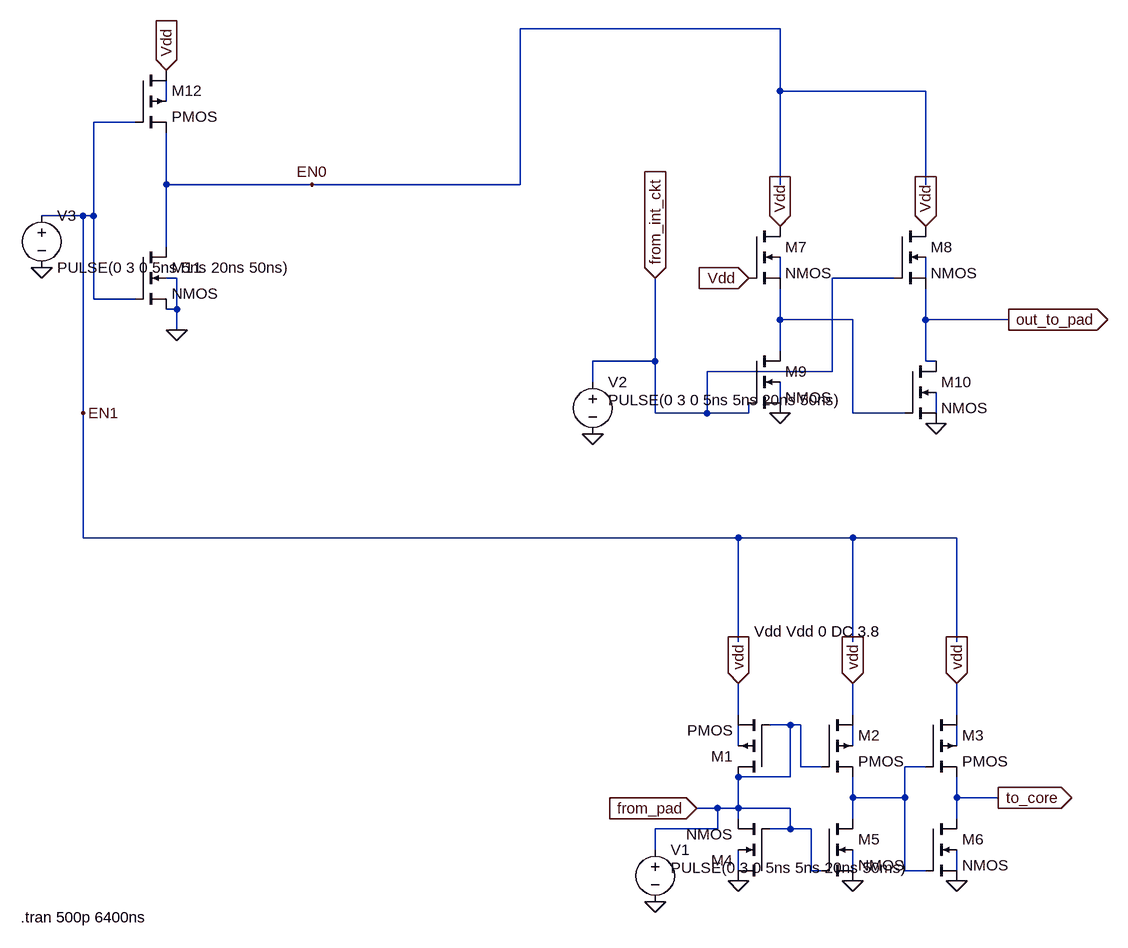
[diagram p0: schematic Gpio@bidibuff.asc]
Gpio@bidibuff.asc, the LTspice schematic file:
Version 4
SHEET 1 880 680
WIRE 144 -1040 -256 -1040
WIRE 144 -944 144 -1040
WIRE 368 -944 144 -944
WIRE -800 -928 -800 -960
WIRE -848 -896 -912 -896
WIRE -800 -800 -800 -880
WIRE -576 -800 -800 -800
WIRE -256 -800 -256 -1040
WIRE -256 -800 -576 -800
WIRE 144 -800 144 -944
WIRE 368 -800 368 -944
WIRE -928 -752 -992 -752
WIRE -912 -752 -912 -896
WIRE -912 -752 -928 -752
WIRE -800 -704 -800 -800
WIRE -784 -656 -800 -656
WIRE 144 -656 144 -688
WIRE 320 -656 224 -656
WIRE 368 -656 368 -688
WIRE -912 -624 -912 -752
WIRE -848 -624 -912 -624
WIRE -784 -608 -784 -656
WIRE -784 -608 -800 -608
WIRE 144 -592 144 -640
WIRE 256 -592 144 -592
WIRE 368 -592 368 -640
WIRE 496 -592 368 -592
WIRE -784 -576 -784 -608
WIRE 144 -544 144 -592
WIRE -48 -528 -48 -656
WIRE -48 -528 -144 -528
WIRE 368 -528 368 -592
WIRE 384 -528 368 -528
WIRE 224 -512 224 -656
WIRE 224 -512 32 -512
WIRE -144 -496 -144 -528
WIRE 144 -464 144 -496
WIRE -928 -448 -928 -752
WIRE -48 -448 -48 -528
WIRE 32 -448 32 -512
WIRE 32 -448 -48 -448
WIRE 96 -448 96 -464
WIRE 96 -448 32 -448
WIRE 256 -448 256 -592
WIRE 336 -448 256 -448
WIRE 384 -448 384 -480
WIRE -928 -256 -928 -448
WIRE 80 -256 -928 -256
WIRE 256 -256 80 -256
WIRE 416 -256 256 -256
WIRE 80 -96 80 -256
WIRE 256 -96 256 -256
WIRE 416 -96 416 -256
WIRE 80 16 80 -32
WIRE 256 16 256 -32
WIRE 416 16 416 -32
WIRE 160 32 128 32
WIRE 176 32 160 32
WIRE 80 64 80 32
WIRE 256 64 256 32
WIRE 416 64 416 32
WIRE 176 96 176 32
WIRE 208 96 176 96
WIRE 368 96 336 96
WIRE 160 112 160 32
WIRE 160 112 80 112
WIRE 256 144 256 112
WIRE 336 144 336 96
WIRE 336 144 256 144
WIRE 416 144 416 112
WIRE 480 144 416 144
WIRE 48 160 16 160
WIRE 80 160 80 112
WIRE 80 160 48 160
WIRE 160 160 80 160
WIRE 80 176 80 160
WIRE 256 176 256 144
WIRE 416 176 416 144
WIRE 48 192 48 160
WIRE 48 192 -48 192
WIRE 160 192 160 160
WIRE 160 192 128 192
WIRE 192 192 160 192
WIRE -48 224 -48 192
WIRE 80 256 80 224
WIRE 192 256 192 192
WIRE 208 256 192 256
WIRE 256 256 256 224
WIRE 336 256 336 144
WIRE 368 256 336 256
WIRE 416 256 416 224
FLAG 80 272 0
FLAG 256 272 0
FLAG 416 272 0
FLAG 16 160 from_pad
IOPIN 16 160 In
FLAG 480 144 to_core
IOPIN 480 144 Out
FLAG 80 -32 vdd
IOPIN 80 -32 In
FLAG 256 -32 vdd
IOPIN 256 -32 In
FLAG 416 -32 vdd
IOPIN 416 -32 In
FLAG -48 304 0
FLAG 384 -432 0
FLAG 144 -448 0
FLAG 144 -736 Vdd
IOPIN 144 -736 In
FLAG 368 -736 Vdd
IOPIN 368 -736 In
FLAG 96 -656 Vdd
IOPIN 96 -656 In
FLAG 496 -592 out_to_pad
IOPIN 496 -592 Out
FLAG -144 -416 0
FLAG -48 -656 from_int_ckt
IOPIN -48 -656 In
FLAG -784 -576 0
FLAG -992 -672 0
FLAG -800 -976 Vdd
IOPIN -800 -976 In
FLAG -928 -448 EN1
FLAG -576 -800 EN0
SYMBOL pmos4 128 112 R180
SYMATTR InstName M1
SYMBOL pmos4 208 16 R0
SYMATTR InstName M2
SYMBOL pmos4 368 16 R0
SYMATTR InstName M3
SYMBOL nmos4 208 176 R0
SYMATTR InstName M5
SYMBOL nmos4 368 176 R0
SYMATTR InstName M6
SYMBOL nmos4 128 272 R180
SYMATTR InstName M4
SYMBOL voltage -48 208 R0
WINDOW 123 0 0 Left 0
WINDOW 39 0 0 Left 0
WINDOW 3 24 44 Left 2
SYMATTR Value PULSE(0 3 0 5ns 5ns 20ns 50ms)
SYMATTR InstName V1
SYMBOL nmos4 96 -736 R0
SYMATTR InstName M7
SYMBOL nmos4 320 -736 R0
SYMATTR InstName M8
SYMBOL nmos4 96 -544 R0
SYMATTR InstName M9
SYMBOL nmos4 336 -528 R0
SYMATTR InstName M10
SYMBOL voltage -144 -512 R0
WINDOW 3 24 44 Left 2
WINDOW 123 0 0 Left 0
WINDOW 39 0 0 Left 0
SYMATTR Value PULSE(0 3 0 5ns 5ns 20ns 50ns)
SYMATTR InstName V2
SYMBOL nmos4 -848 -704 R0
SYMATTR InstName M11
SYMBOL pmos4 -848 -976 R0
SYMATTR InstName M12
SYMBOL voltage -992 -768 R0
WINDOW 123 0 0 Left 0
WINDOW 39 0 0 Left 0
SYMATTR InstName V3
SYMATTR Value PULSE(0 3 0 5ns 5ns 20ns 50ns)
TEXT 104 -112 Left 2 !Vdd Vdd 0 DC 3.8
TEXT -1024 328 Left 2 !.tran 500p 6400ns

The netlist it stands for:
* Gpio@bidibuff.asc
M1 from_pad from_pad vdd N007 PMOS
M2 vdd from_pad N010 N008 PMOS
M3 vdd N010 to_core N009 PMOS
M5 N010 from_pad 0 N012 NMOS
M6 to_core N010 0 N013 NMOS
M4 0 from_pad from_pad N011 NMOS
V1 from_pad 0 PULSE(0 3 0 5ns 5ns 20ns 50ms)
M7 vdd vdd N004 N002 NMOS
M8 vdd from_int_ckt out_to_pad N003 NMOS
M9 N004 from_int_ckt 0 N005 NMOS
M10 out_to_pad N004 0 N006 NMOS
V2 from_int_ckt 0 PULSE(0 3 0 5ns 5ns 20ns 50ns)
M11 EN0 EN1 0 0 NMOS
M12 vdd EN1 EN0 N001 PMOS
V3 EN1 0 PULSE(0 3 0 5ns 5ns 20ns 50ns)
.model NMOS NMOS
.model PMOS PMOS
.lib standard.mos
Vdd Vdd 0 DC 3.8
.tran 500p 6400ns
.backanno
.end

* Results of the author's LTspice run, read from the files saved beside the schematic
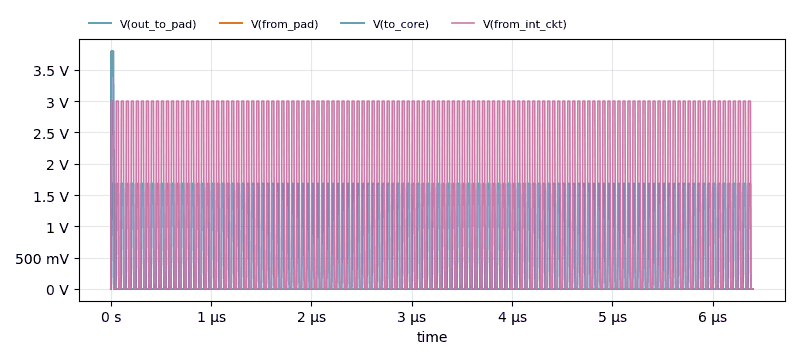
[diagram p1: Transient Analysis of Gpio@bidibuff.asc, plotted from the saved traces]
* Transient Analysis, 1 run:
*   V(out_to_pad): min 0 V, max 1.683 V, average 775.7 mV, rms 1.111 V, last 0 V
*   V(from_pad): min 0 V, max 3 V, average 11.72 mV, rms 181.2 mV, last 0 V
*   V(to_core): min 0 V, max 3.798 V, average 13.98 mV, rms 229 mV, last 0 V
*   V(from_int_ckt): min 0 V, max 3 V, average 1.5 V, rms 2.051 V, last 0 V